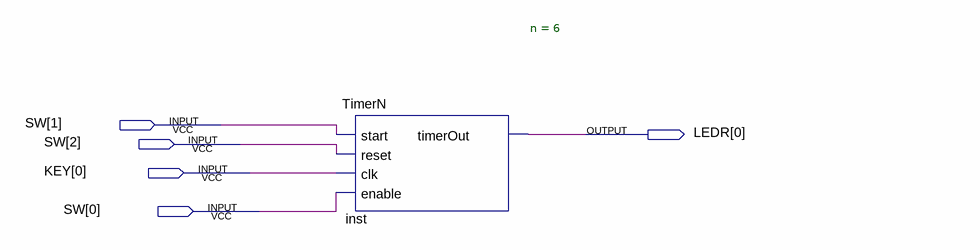
[diagram p0: schematic sheet]
// Quartus schematic TimerN_Demo.bdf as structural Verilog: 1 symbols, 5 pins
module TimerN_Demo (
  input  [2:0] SW,
  input  [0:0] KEY,
  output [0:0] LEDR
);

  TimerN #(.n(6)) inst (.start(SW[1]), .reset(SW[2]), .clk(KEY[0]), .enable(SW[0]), .timerOut(LEDR[0]));
endmodule
